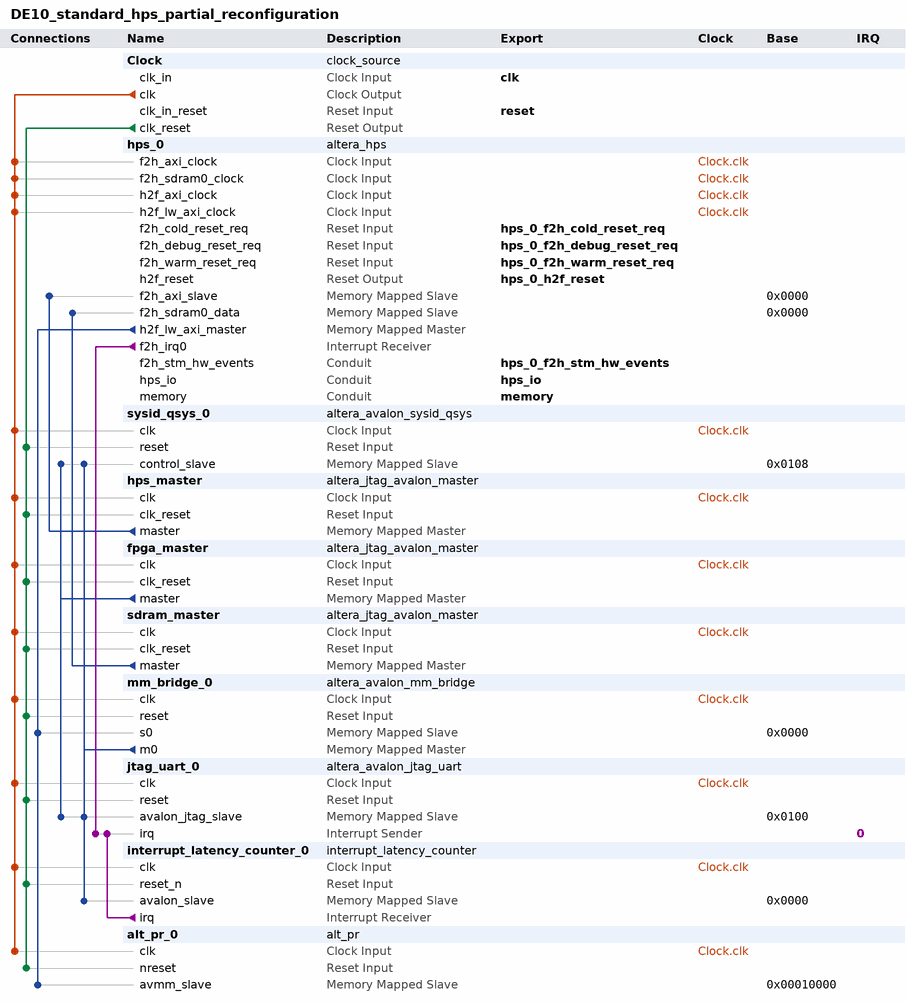
[diagram p0: system contents]
# Platform Designer (Qsys) system DE10_standard_hps_partial_reconfiguration, Cyclone V 5CSXFC6D6F31C6
# Parameters at their usual value, and those the tool derives, are not listed.
package require -exact qsys 15.0
create_system DE10_standard_hps_partial_reconfiguration
set_project_property DEVICE_FAMILY {Cyclone V}
set_project_property DEVICE 5CSXFC6D6F31C6

add_instance Clock clock_source 15.0
set_instance_parameter_value Clock clockFrequency 50000000

add_instance hps_0 altera_hps 15.0
set_instance_parameter_value hps_0 EMAC1_Mode RGMII
set_instance_parameter_value hps_0 EMAC1_PinMuxing {HPS I/O Set 0}
set_instance_parameter_value hps_0 F2SCLK_COLDRST_Enable true
set_instance_parameter_value hps_0 F2SCLK_DBGRST_Enable true
set_instance_parameter_value hps_0 F2SCLK_WARMRST_Enable true
set_instance_parameter_value hps_0 F2SDRAM_Type {Avalon-MM Bidirectional}
set_instance_parameter_value hps_0 F2SDRAM_Width 256
set_instance_parameter_value hps_0 F2SINTERRUPT_Enable true
set_instance_parameter_value hps_0 F2S_Width 2
set_instance_parameter_value hps_0 FPGA_PERIPHERAL_OUTPUT_CLOCK_FREQ_EMAC0_GTX_CLK 100
set_instance_parameter_value hps_0 FPGA_PERIPHERAL_OUTPUT_CLOCK_FREQ_EMAC0_MD_CLK 2.5
set_instance_parameter_value hps_0 FPGA_PERIPHERAL_OUTPUT_CLOCK_FREQ_EMAC1_GTX_CLK 100
set_instance_parameter_value hps_0 FPGA_PERIPHERAL_OUTPUT_CLOCK_FREQ_EMAC1_MD_CLK 2.5
set_instance_parameter_value hps_0 HPS_PROTOCOL DDR3
set_instance_parameter_value hps_0 I2C0_Mode I2C
set_instance_parameter_value hps_0 I2C0_PinMuxing {HPS I/O Set 0}
set_instance_parameter_value hps_0 I2C1_Mode I2C
set_instance_parameter_value hps_0 I2C1_PinMuxing {HPS I/O Set 0}
set_instance_parameter_value hps_0 LWH2F_Enable true
set_instance_parameter_value hps_0 MEM_BANKADDR_WIDTH 3
set_instance_parameter_value hps_0 MEM_CLK_FREQ 400.0
set_instance_parameter_value hps_0 MEM_COL_ADDR_WIDTH 10
set_instance_parameter_value hps_0 MEM_DQ_WIDTH 32
set_instance_parameter_value hps_0 MEM_DRV_STR RZQ/6
set_instance_parameter_value hps_0 MEM_ROW_ADDR_WIDTH 15
set_instance_parameter_value hps_0 MEM_RTT_NOM RZQ/6
set_instance_parameter_value hps_0 MEM_RTT_WR {Dynamic ODT off}
set_instance_parameter_value hps_0 MEM_TCL 11
set_instance_parameter_value hps_0 MEM_TFAW_NS 45.0
set_instance_parameter_value hps_0 MEM_TRAS_NS 35.0
set_instance_parameter_value hps_0 MEM_TRCD_NS 13.75
set_instance_parameter_value hps_0 MEM_TRFC_NS 260.0
set_instance_parameter_value hps_0 MEM_TRP_NS 13.75
set_instance_parameter_value hps_0 MEM_VENDOR Micron
set_instance_parameter_value hps_0 MEM_WTCL 7
set_instance_parameter_value hps_0 QSPI_Mode {1 SS}
set_instance_parameter_value hps_0 QSPI_PinMuxing {HPS I/O Set 0}
set_instance_parameter_value hps_0 REF_CLK_FREQ 25.0
set_instance_parameter_value hps_0 S2F_Width 3
set_instance_parameter_value hps_0 SDIO_Mode {4-bit Data}
set_instance_parameter_value hps_0 SDIO_PinMuxing {HPS I/O Set 0}
set_instance_parameter_value hps_0 SPIM0_Mode {Single Slave Select}
set_instance_parameter_value hps_0 SPIM0_PinMuxing {HPS I/O Set 0}
set_instance_parameter_value hps_0 SPIM1_Mode {Single Slave Select}
set_instance_parameter_value hps_0 SPIM1_PinMuxing {HPS I/O Set 0}
set_instance_parameter_value hps_0 STM_Enable true
set_instance_parameter_value hps_0 TIMING_BOARD_AC_SKEW 0.01
set_instance_parameter_value hps_0 TIMING_BOARD_AC_TO_CK_SKEW 0.01
set_instance_parameter_value hps_0 TIMING_BOARD_DQ_TO_DQS_SKEW 0.05
set_instance_parameter_value hps_0 TIMING_BOARD_MAX_CK_DELAY 0.03
set_instance_parameter_value hps_0 TIMING_BOARD_MAX_DQS_DELAY 0.02
set_instance_parameter_value hps_0 TIMING_BOARD_SKEW_BETWEEN_DQS 0.06
set_instance_parameter_value hps_0 TIMING_BOARD_SKEW_CKDQS_DIMM_MAX 0.12
set_instance_parameter_value hps_0 TIMING_BOARD_SKEW_CKDQS_DIMM_MIN 0.06
set_instance_parameter_value hps_0 TIMING_BOARD_SKEW_WITHIN_DQS 0.01
set_instance_parameter_value hps_0 TIMING_TDH 65
set_instance_parameter_value hps_0 TIMING_TDQSCK 255
set_instance_parameter_value hps_0 TIMING_TDQSQ 125
set_instance_parameter_value hps_0 TIMING_TDS 30
set_instance_parameter_value hps_0 TIMING_TIH 140
set_instance_parameter_value hps_0 TIMING_TIS 190
set_instance_parameter_value hps_0 TIMING_TQSH 0.4
set_instance_parameter_value hps_0 UART0_Mode {No Flow Control}
set_instance_parameter_value hps_0 UART0_PinMuxing {HPS I/O Set 0}
set_instance_parameter_value hps_0 USB1_Mode SDR
set_instance_parameter_value hps_0 USB1_PinMuxing {HPS I/O Set 0}
set_instance_parameter_value hps_0 desired_cfg_clk_mhz 100.0
set_instance_parameter_value hps_0 desired_qspi_clk_mhz 400.0

add_instance sysid_qsys_0 altera_avalon_sysid_qsys 15.0
set_instance_parameter_value sysid_qsys_0 id -1437226411

add_instance hps_master altera_jtag_avalon_master 15.0

add_instance fpga_master altera_jtag_avalon_master 15.0

add_instance sdram_master altera_jtag_avalon_master 15.0

add_instance mm_bridge_0 altera_avalon_mm_bridge 15.0
set_instance_parameter_value mm_bridge_0 ADDRESS_UNITS SYMBOLS
set_instance_parameter_value mm_bridge_0 ADDRESS_WIDTH 10
set_instance_parameter_value mm_bridge_0 DATA_WIDTH 32
set_instance_parameter_value mm_bridge_0 MAX_PENDING_RESPONSES 4
set_instance_parameter_value mm_bridge_0 USE_AUTO_ADDRESS_WIDTH 1

add_instance jtag_uart_0 altera_avalon_jtag_uart 15.0
set_instance_parameter_value jtag_uart_0 simInteractiveOptions NO_INTERACTIVE_WINDOWS

add_instance interrupt_latency_counter_0 interrupt_latency_counter 15.0
set_instance_parameter_value interrupt_latency_counter_0 IRQ_PORT_CNT 2

add_instance alt_pr_0 alt_pr 15.0
set_instance_parameter_value alt_pr_0 CDRATIO 1
set_instance_parameter_value alt_pr_0 DATA_WIDTH_INDEX 16
set_instance_parameter_value alt_pr_0 EDCRC_OSC_DIVIDER 1
set_instance_parameter_value alt_pr_0 ENABLE_AVMM_SLAVE true
set_instance_parameter_value alt_pr_0 ENABLE_JTAG true
set_instance_parameter_value alt_pr_0 ENABLE_PRPOF_ID_CHECK_UI false
set_instance_parameter_value alt_pr_0 EXT_HOST_PRPOF_ID 0
set_instance_parameter_value alt_pr_0 EXT_HOST_TARGET_DEVICE_FAMILY {Stratix V}
set_instance_parameter_value alt_pr_0 PR_INTERNAL_HOST false

# connections
add_connection Clock.clk alt_pr_0.clk clock
add_connection Clock.clk fpga_master.clk clock
add_connection Clock.clk hps_0.f2h_axi_clock clock
add_connection Clock.clk hps_0.f2h_sdram0_clock clock
add_connection Clock.clk hps_0.h2f_axi_clock clock
add_connection Clock.clk hps_0.h2f_lw_axi_clock clock
add_connection Clock.clk hps_master.clk clock
add_connection Clock.clk interrupt_latency_counter_0.clk clock
add_connection Clock.clk jtag_uart_0.clk clock
add_connection Clock.clk mm_bridge_0.clk clock
add_connection Clock.clk sdram_master.clk clock
add_connection Clock.clk sysid_qsys_0.clk clock
add_connection Clock.clk_reset alt_pr_0.nreset reset
add_connection Clock.clk_reset fpga_master.clk_reset reset
add_connection Clock.clk_reset hps_master.clk_reset reset
add_connection Clock.clk_reset interrupt_latency_counter_0.reset_n reset
add_connection Clock.clk_reset jtag_uart_0.reset reset
add_connection Clock.clk_reset mm_bridge_0.reset reset
add_connection Clock.clk_reset sdram_master.clk_reset reset
add_connection Clock.clk_reset sysid_qsys_0.reset reset
add_connection fpga_master.master jtag_uart_0.avalon_jtag_slave avalon
set_connection_parameter_value fpga_master.master/jtag_uart_0.avalon_jtag_slave baseAddress 0x0100
add_connection fpga_master.master sysid_qsys_0.control_slave avalon
set_connection_parameter_value fpga_master.master/sysid_qsys_0.control_slave baseAddress 0x0108
add_connection hps_0.h2f_lw_axi_master alt_pr_0.avmm_slave avalon
set_connection_parameter_value hps_0.h2f_lw_axi_master/alt_pr_0.avmm_slave baseAddress 0x00010000
add_connection hps_0.h2f_lw_axi_master mm_bridge_0.s0 avalon
set_connection_parameter_value hps_0.h2f_lw_axi_master/mm_bridge_0.s0 baseAddress 0x0000
add_connection hps_master.master hps_0.f2h_axi_slave avalon
set_connection_parameter_value hps_master.master/hps_0.f2h_axi_slave baseAddress 0x0000
add_connection mm_bridge_0.m0 interrupt_latency_counter_0.avalon_slave avalon
set_connection_parameter_value mm_bridge_0.m0/interrupt_latency_counter_0.avalon_slave baseAddress 0x0000
add_connection mm_bridge_0.m0 jtag_uart_0.avalon_jtag_slave avalon
set_connection_parameter_value mm_bridge_0.m0/jtag_uart_0.avalon_jtag_slave baseAddress 0x0100
add_connection mm_bridge_0.m0 sysid_qsys_0.control_slave avalon
set_connection_parameter_value mm_bridge_0.m0/sysid_qsys_0.control_slave baseAddress 0x0108
add_connection sdram_master.master hps_0.f2h_sdram0_data avalon
set_connection_parameter_value sdram_master.master/hps_0.f2h_sdram0_data baseAddress 0x0000
add_connection hps_0.f2h_irq0 jtag_uart_0.irq interrupt
set_connection_parameter_value hps_0.f2h_irq0/jtag_uart_0.irq irqNumber 1
add_connection interrupt_latency_counter_0.irq jtag_uart_0.irq interrupt
set_connection_parameter_value interrupt_latency_counter_0.irq/jtag_uart_0.irq irqNumber 0

# exported interfaces
add_interface clk clock sink
set_interface_property clk EXPORT_OF Clock.clk_in
add_interface hps_0_f2h_cold_reset_req reset sink
set_interface_property hps_0_f2h_cold_reset_req EXPORT_OF hps_0.f2h_cold_reset_req
add_interface hps_0_f2h_debug_reset_req reset sink
set_interface_property hps_0_f2h_debug_reset_req EXPORT_OF hps_0.f2h_debug_reset_req
add_interface hps_0_f2h_stm_hw_events conduit end
set_interface_property hps_0_f2h_stm_hw_events EXPORT_OF hps_0.f2h_stm_hw_events
add_interface hps_0_f2h_warm_reset_req reset sink
set_interface_property hps_0_f2h_warm_reset_req EXPORT_OF hps_0.f2h_warm_reset_req
add_interface hps_0_h2f_reset reset source
set_interface_property hps_0_h2f_reset EXPORT_OF hps_0.h2f_reset
add_interface hps_io conduit end
set_interface_property hps_io EXPORT_OF hps_0.hps_io
add_interface memory conduit end
set_interface_property memory EXPORT_OF hps_0.memory
add_interface reset reset sink
set_interface_property reset EXPORT_OF Clock.clk_in_reset

set_interconnect_requirement {$system} qsys_mm.clockCrossingAdapter HANDSHAKE
set_interconnect_requirement {$system} qsys_mm.enableEccProtection FALSE
set_interconnect_requirement {$system} qsys_mm.insertDefaultSlave FALSE
set_interconnect_requirement {$system} qsys_mm.maxAdditionalLatency 1

save_system DE10_standard_hps_partial_reconfiguration.qsys
